# Altium project ARTIX_Codex_Verified.PrjPcb
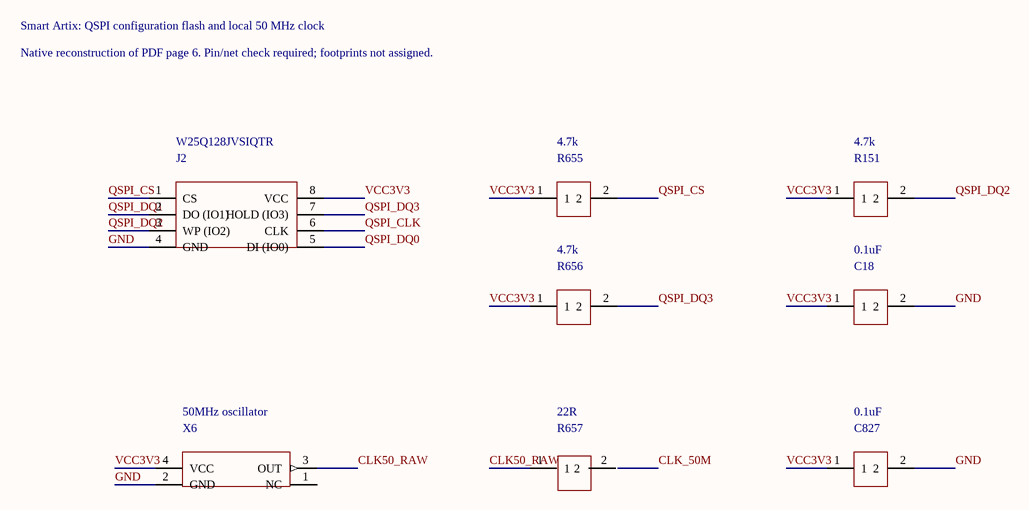
[diagram p0: Clock_Flash_Verified.SchDoc]
1 sheet, 8 parts. Net scope: global (net labels, ports and power ports of the same name join across sheets).

## Sheet Clock_Flash_Verified.SchDoc
size A4; SheetNumber: 1; SheetTotal: 1

### Parts
C18  0.1uF
C827  0.1uF
J2  W25Q128JVSIQTR
R151  4.7k
R655  4.7k
R656  4.7k
R657  22R
X6  50MHz oscillator

### Nets
CLK50_RAW: R657.1 X6.3(OUT)
GND: C18.2 C827.2 J2.4(GND) X6.2(GND)
QSPI_CLK: J2.6(CLK)
QSPI_CS: J2.1(CS) R655.2
QSPI_DQ0: J2.5(DI_(IO0))
QSPI_DQ1: J2.2(DO_(IO1))
QSPI_DQ2: J2.3(WP_(IO2)) R151.2
QSPI_DQ3: J2.7(HOLD_(IO3)) R656.2
VCC3V3: C18.1 C827.1 J2.8(VCC) R151.1 R655.1 R656.1 X6.4(VCC)

Not connected (* = marked no-connect by the designer): R657 2; X6 1(NC)

### Notes on the sheet
- Smart Artix: QSPI configuration flash and local 50 MHz clock
- Native reconstruction of PDF page 6. Pin/net check required; footprints not assigned.

### Library data of the parts
C18 C827 = 0.1uF: Reconstructed from Smart Artix reference PDF; ReviewStatus: DRAFT - pin/net verification required; footprint not assigned; Source: Schematic_Smart_Artix_251120.pdf page 6
J2 = W25Q128JVSIQTR: Reconstructed from Smart Artix reference PDF; ReviewStatus: DRAFT - pin/net verification required; footprint not assigned; Source: Schematic_Smart_Artix_251120.pdf page 6
R151 R655 R656 = 4.7k: Reconstructed from Smart Artix reference PDF; ReviewStatus: DRAFT - pin/net verification required; footprint not assigned; Source: Schematic_Smart_Artix_251120.pdf page 6
R657 = 22R: Reconstructed from Smart Artix reference PDF; ReviewStatus: DRAFT - pin/net verification required; footprint not assigned; Source: Schematic_Smart_Artix_251120.pdf page 6
X6 = 50MHz oscillator: Reconstructed from Smart Artix reference PDF; ReviewStatus: DRAFT - pin/net verification required; footprint not assigned; Source: Schematic_Smart_Artix_251120.pdf page 6